# EAGLE design 2xVCA (EAGLE 7.1.0)
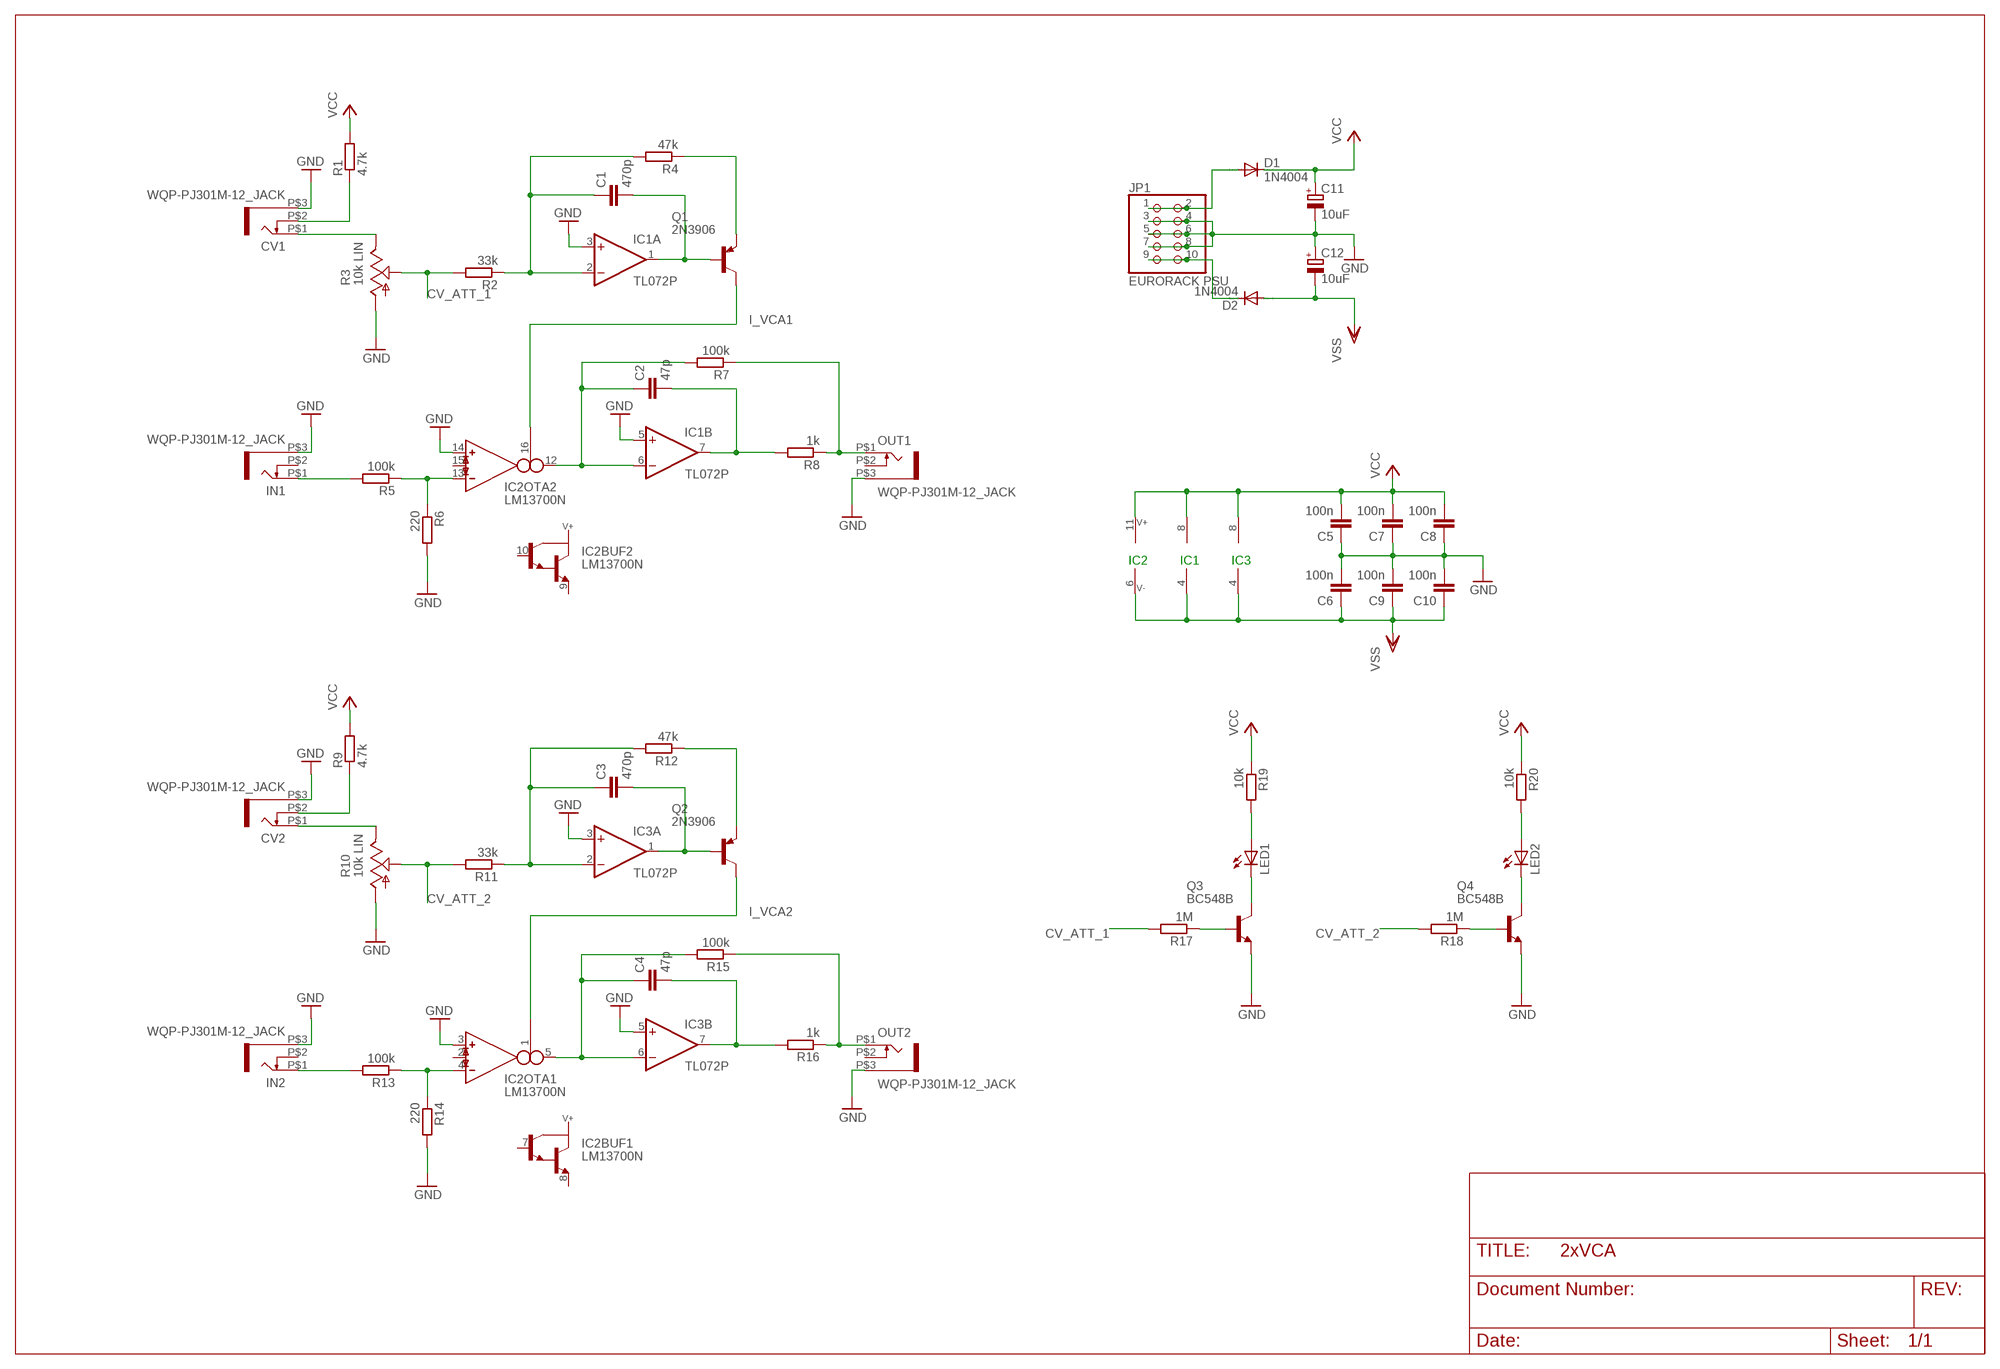
[diagram p0: schematic, sheet 1]

## Parts
C1  470p  C-EU025-025X050  [C025-025X050]
C2  47p  C-EU025-025X050  [C025-025X050]
C3  470p  C-EU025-025X050  [C025-025X050]
C4  47p  C-EU025-025X050  [C025-025X050]
C5  100n  C-EU025-025X050  [C025-025X050]
C6  100n  C-EU025-025X050  [C025-025X050]
C7  100n  C-EU025-025X050  [C025-025X050]
C8  100n  C-EU025-025X050  [C025-025X050]
C9  100n  C-EU025-025X050  [C025-025X050]
C10  100n  C-EU025-025X050  [C025-025X050]
C11  10uF  CPOL-EUE2.5-5  [E2,5-5]
C12  10uF  CPOL-EUE2.5-5  [E2,5-5]
CV1  WQP-PJ301M-12_JACK  [WQP-PJ301M-12_JACK]
CV2  WQP-PJ301M-12_JACK  [WQP-PJ301M-12_JACK]
D1  1N4004  [DO41-10]
D2  1N4004  [DO41-10]
IC1  TL072P  [DIL08]
IC2  LM13700N  [DIL16]
IC3  TL072P  [DIL08]
IN1  WQP-PJ301M-12_JACK  [WQP-PJ301M-12_JACK]
IN2  WQP-PJ301M-12_JACK  [WQP-PJ301M-12_JACK]
JP1  EURORACK PSU  PINHD-2X5  [2X05]
LED1  LED3MM  [LED3MM]
LED2  LED3MM  [LED3MM]
OUT1  WQP-PJ301M-12_JACK  [WQP-PJ301M-12_JACK]
OUT2  WQP-PJ301M-12_JACK  [WQP-PJ301M-12_JACK]
Q1  2N3906  [TO92]
Q2  2N3906  [TO92]
Q3  BC548B  [TO92-EBC]
Q4  BC548B  [TO92-EBC]
R1  4.7k  R-EU_0207/2V  [0207/2V]
R2  33k  R-EU_0207/2V  [0207/2V]
R3  10k LIN  POT_USVERTICAL  [ALPS_POT_VERTICAL]
R4  47k  R-EU_0207/2V  [0207/2V]
R5  100k  R-EU_0207/2V  [0207/2V]
R6  220  R-EU_0207/2V  [0207/2V]
R7  100k  R-EU_0207/2V  [0207/2V]
R8  1k  R-EU_0207/2V  [0207/2V]
R9  4.7k  R-EU_0207/2V  [0207/2V]
R10  10k LIN  POT_USVERTICAL  [ALPS_POT_VERTICAL]
R11  33k  R-EU_0207/2V  [0207/2V]
R12  47k  R-EU_0207/2V  [0207/2V]
R13  100k  R-EU_0207/2V  [0207/2V]
R14  220  R-EU_0207/2V  [0207/2V]
R15  100k  R-EU_0207/2V  [0207/2V]
R16  1k  R-EU_0207/2V  [0207/2V]
R17  1M  R-EU_0207/2V  [0207/2V]
R18  1M  R-EU_0207/2V  [0207/2V]
R19  10k  R-EU_0207/2V  [0207/2V]
R20  10k  R-EU_0207/2V  [0207/2V]

## Nets
CV_ATT_1: R2.2 R3.P$2(S) R17.2
CV_ATT_2: R10.P$2(S) R11.2 R18.2
GND: C5.1 C6.2 C7.1 C8.1 C9.2 C10.2 C11.- C12.+ CV1.P$3 CV2.P$3 IC1.3(A:+IN) IC1.5(B:+IN) IC2.3(OTA1:IN_P) IC2.14(OTA2:IN_P) IC3.3(A:+IN) IC3.5(B:+IN) IN1.P$3 IN2.P$3 JP1.3 JP1.4 JP1.5 JP1.6 JP1.7 JP1.8 OUT1.P$3 OUT2.P$3 Q3.E Q4.E R3.P$3(A) R6.2 R10.P$3(A) R14.2
I_VCA1: IC2.16(OTA2:I_BIAS) Q1.1(C)
I_VCA2: IC2.1(OTA1:I_BIAS) Q2.1(C)
N$1: IN2.P$1 R13.2
N$2: CV1.P$2 R1.1
N$3: CV1.P$1 R3.P$1(E)
N$4: Q3.B R17.1
N$5: C1.1 IC1.2(A:-IN) R2.1 R4.2
N$6: C2.1 IC1.6(B:-IN) IC2.12(OTA2:OUT) R7.2
N$7: C1.2 IC1.1(A:OUT) Q1.2(B)
N$8: Q1.3(E) R4.1
N$9: IC2.13(OTA2:IN_N) R5.1 R6.1
N$10: IC2.4(OTA1:IN_N) R13.1 R14.1
N$11: IN1.P$1 R5.2
N$12: C2.2 IC1.7(B:OUT) R8.2
N$13: OUT1.P$1 R7.1 R8.1
N$15: C4.1 IC2.5(OTA1:OUT) IC3.6(B:-IN) R15.2
N$16: CV2.P$2 R9.1
N$17: CV2.P$1 R10.P$1(E)
N$18: LED1.A R19.2
N$19: C3.1 IC3.2(A:-IN) R11.1 R12.2
N$20: OUT2.P$1 R15.1 R16.1
N$21: C3.2 IC3.1(A:OUT) Q2.2(B)
N$22: Q2.3(E) R12.1
N$23: C4.2 IC3.7(B:OUT) R16.2
N$24: LED1.K(C) Q3.C
N$25: LED2.A R20.2
N$26: LED2.K(C) Q4.C
N$27: Q4.B R18.1
N$28: D1.A JP1.1 JP1.2
N$30: D2.C JP1.9 JP1.10
VCC: C5.2 C7.2 C8.2 C11.+ D1.C IC1.8(P:V+) IC2.11(SUPPLY:V+) IC3.8(P:V+) R1.2 R9.2 R19.1 R20.1
VSS: C6.1 C9.1 C10.1 C12.- D2.A IC1.4(P:V-) IC2.6(SUPPLY:V-) IC3.4(P:V-)
Unconnected: IC2.2(OTA1:I_DIODE) IC2.7(BUF1:B) IC2.8(BUF1:E) IC2.9(BUF2:E) IC2.10(BUF2:B) IC2.15(OTA2:I_DIODE) IN1.P$2 IN2.P$2 OUT1.P$2 OUT2.P$2

## Notes on the sheet
- IC2 | IC1 | IC3

## Library data of the parts
C1-C10 = rcl:C-EU: CAPACITOR, European symbol
C11 C12 = rcl:CPOL-EU: POLARIZED CAPACITOR, European symbol
CV1 CV2 IN1 IN2 OUT1 OUT2 = thonkiconn:WQP-PJ301M-12_JACK
D1 D2 = diode:1N4004: DIODE general purpose rectifier, 1 A
IC1 IC3 = linear:TL072: OP AMP
IC2 = ota:LM13700: Dual OTA with buffers
JP1 = pinhead:PINHD-2X5: PIN HEADER
LED1 LED2 = led:LED: LED OSRAM: - CHIPLED LG R971, LG N971, LY N971, LG Q971, LY Q971, LO R971, LY R971 LH N974, LH R974 LS Q976, LO Q976, LY Q976 LO Q996 - Hyper CHIPLED LW Q18S LB Q993, LB Q99A, LB R99A - SideLED LS A670, LO A670, LY A670, LG A670, LP A670 LB A673, LV A673, LT A673, LW A673 LH A674 LY A675 LS A676, LA A676, LO A676, LY A676, LW A676 LS A679, LY A679, LG A679 - Hyper Micro SIDELED® LS Y876, LA Y876, LO Y876, LY Y876 LT Y87S - SmartLED LW L88C, LW L88S LB L89C, LB L89S, LG L890 LS L89K, LO L89K, LY L89K LS L896, LA L896, LO L896, LY L896 - TOPLED LS T670, LO T670, LY T670, LG T670, LP T670 LSG T670, LSP T670, LSY T670, LOP T670, LYG T670 LG T671, LOG T671, LSG T671 LB T673, LV T673, LT T673, LW T673 LH T674 LS T676, LA T676, LO T676, LY T676, LB T676, LH T676, LSB T676, LW T676 LB T67C, LV T67C, LT T67C, LS T67K, LO T67K, LY T67K, LW E67C LS E67B, LA E67B, LO E67B, LY E67B, LB E67C, LV E67C, LT E67C LW T67C LS T679, LY T679, LG T679 LS T770, LO T770, LY T770, LG T770, LP T770 LB T773, LV T773, LT T773, LW T773 LH T774 LS E675, LA E675, LY E675, LS T675 LS T776, LA T776, LO T776, LY T776, LB T776 LHGB T686 LT T68C, LB T68C - Hyper Mini TOPLED® LB M676 - Mini TOPLED Santana® LG M470 LS M47K, LO M47K, LY M47K Source: http://www.osram.convergy.de LUXEON: - LUMILED® LXK2-PW12-R00, LXK2-PW12-S00, LXK2-PW14-U00, LXK2-PW14-V00 LXK2-PM12-R00, LXK2-PM12-S00, LXK2-PM14-U00 LXK2-PE12-Q00, LXK2-PE12-R00, LXK2-PE12-S00, LXK2-PE14-T00, LXK2-PE14-U00 LXK2-PB12-K00, LXK2-PB12-L00, LXK2-PB12-M00, LXK2-PB14-N00, LXK2-PB14-P00, LXK2-PB14-Q00 LXK2-PR12-L00, LXK2-PR12-M00, LXK2-PR14-Q00, LXK2-PR14-R00 LXK2-PD12-Q00, LXK2-PD12-R00, LXK2-PD12-S00 LXK2-PH12-R00, LXK2-PH12-S00 LXK2-PL12-P00, LXK2-PL12-Q00, LXK2-PL12-R00 Source: www.luxeon.com KINGBRIGHT: KA-3528ASYC Source: www.kingbright.com
Q1 Q2 = transistor-pnp:2N3906: PNP Transistor
Q3 Q4 = transistor-npn:BC548*: NPN Transistor
R1 R2 R4-R9 R11-R20 = rcl:R-EU_: RESISTOR, European symbol
R3 R10 = pot-alps:POT_US

## Board
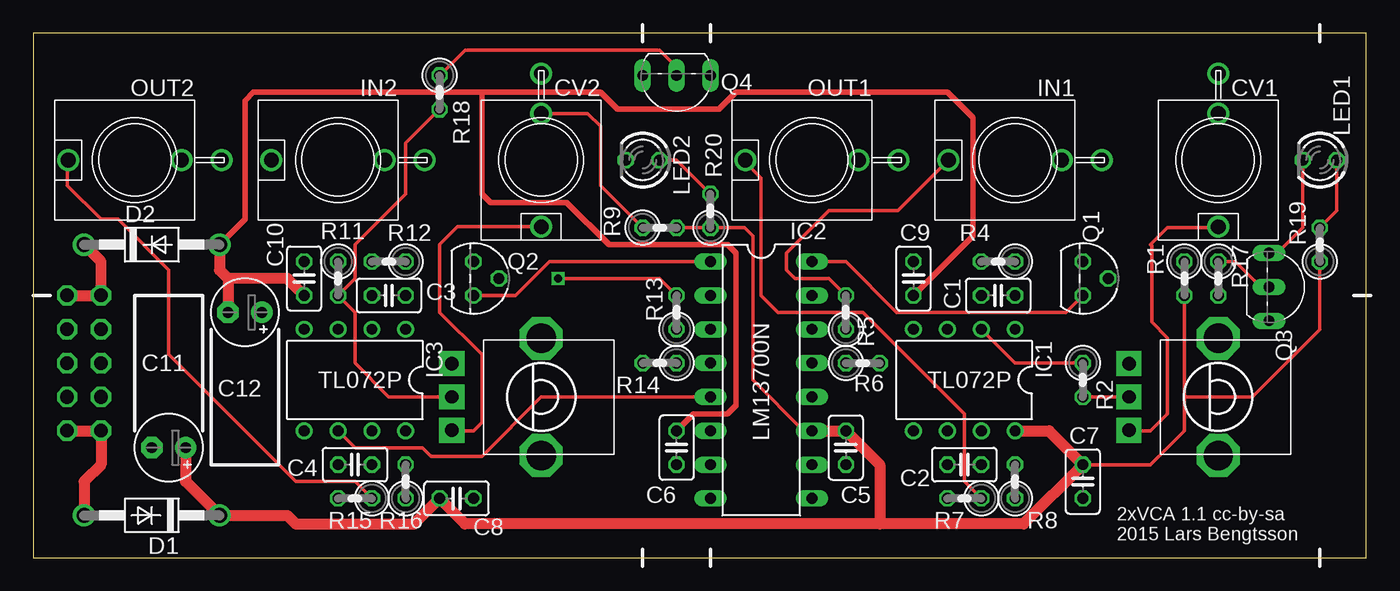
[diagram p1: board, top side]
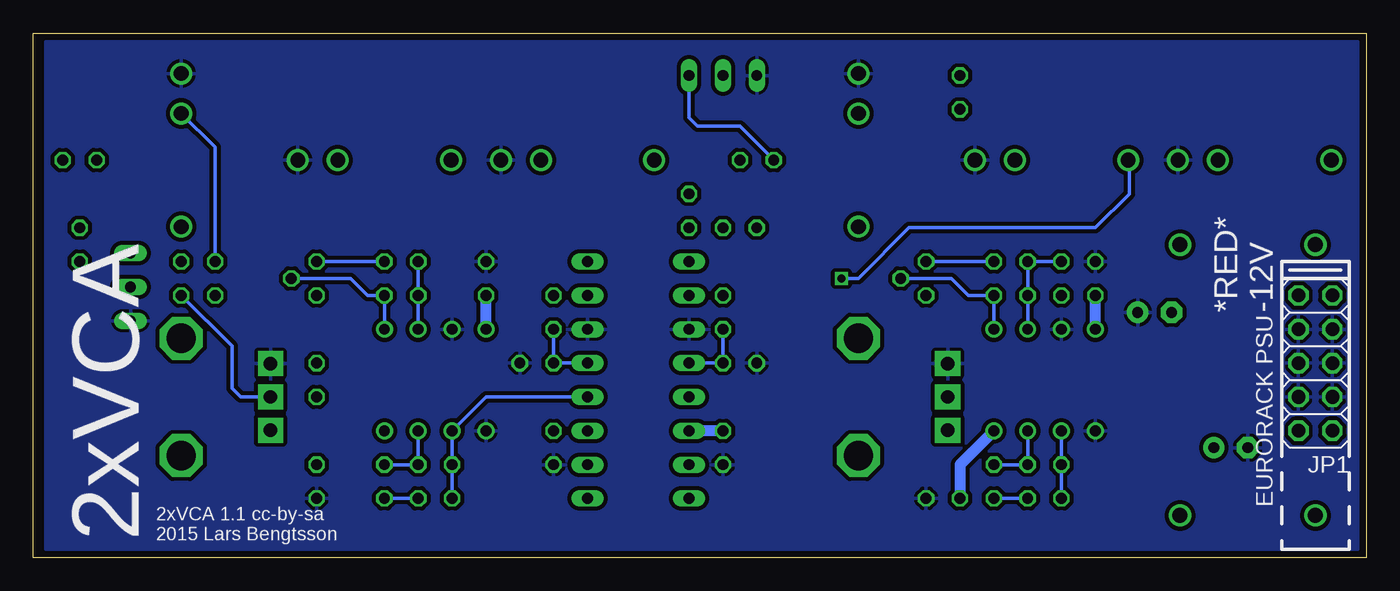
[diagram p2: board, bottom side, seen from below]

Size 100 x 39.36 mm. Coordinates in mm from the lower left corner, seen from the top.
Outline: 0,0 100,0 100,39.36 0,39.36 0,0
Copper layers (1*16): Top 0.0356mm / dielectric 1.5011mm / Bottom 0.0356mm
Design rules "LaenPCBOrder": minimum track width 6mil, minimum drill 13mil, track to track 6mil, track to pad 6mil, pad to pad 6mil, via to via 6mil, smd to smd 6mil, copper to edge 15mil, drill to drill 6mil, minimum pad ring 7mil, minimum via ring 7mil, stop-mask expansion 3mil, vias tented up to drill 0mil, thermal gap 10mil

### Footprints (pad centres in the part's own frame; a part is rotated, then mirrored left to right if it is on the bottom)
C025-025X050 = drill 0.813 octagon: 1 -1.27,0; 2 1.27,0
E2,5-5 = drill 0.813 pad 1.6: + -1.27,0 | drill 0.813 pad 1.6 octagon: - 1.27,0
WQP-PJ301M-12_JACK = drill 1.1: P$1 0,5; P$2 0,-3.5; P$3 0,-6.5
DO41-10 = drill 1.118: A 5.08,0; C -5.08,0
DIL08 = drill 0.813 pad 1.27: 1 -3.81,-3.81; 2 -1.27,-3.81; 3 1.27,-3.81; 4 3.81,-3.81; 5 3.81,3.81; 6 1.27,3.81; 7 -1.27,3.81; 8 -3.81,3.81
DIL16 = drill 0.813 long: 1 -8.89,-3.81; 2 -6.35,-3.81; 3 -3.81,-3.81; 4 -1.27,-3.81; 5 1.27,-3.81; 6 3.81,-3.81; 7 6.35,-3.81; 8 8.89,-3.81; 9 8.89,3.81; 10 6.35,3.81; 11 3.81,3.81; 12 1.27,3.81; 13 -1.27,3.81; 14 -3.81,3.81; 15 -6.35,3.81; 16 -8.89,3.81
2X05 = drill 1.016 octagon: 1 -5.08,-1.27; 2 -5.08,1.27; 3 -2.54,-1.27; 4 -2.54,1.27; 5 0,-1.27; 6 0,1.27; 7 2.54,-1.27; 8 2.54,1.27; 9 5.08,-1.27; 10 5.08,1.27
LED3MM = drill 0.813 octagon: A -1.27,0; K 1.27,0
TO92 = drill 0.813 octagon: 1 1.27,0; 2 0,1.905; 3 -1.27,0
TO92-EBC = drill 0.813 long: B 0,-1.27; C -2.54,-1.27; E 2.54,-1.27
0207/2V = drill 0.813 octagon: 1 -1.27,0; 2 1.27,0
ALPS_POT_VERTICAL = drill 1 pad 1.88 square: P$1 -2.5,6.7; P$2 0,6.7; P$3 2.5,6.7 | drill 2.2 pad 3.175 octagon: P$4 -4.4,0; P$5 4.4,0

### Placement (x,y rotation side)
C1  72.39,19.68 0 top
C2  69.85,6.99 0 top
C3  26.67,19.68 0 top
C4  24.13,6.99 0 top
C5  60.96,8.26 90 top
C6  48.26,8.26 270 top
C7  78.74,5.71 90 top
C8  31.75,4.45 180 top
C9  66.04,20.95 90 top
C10  20.32,20.95 90 top
C11  10.16,8.26 180 top
C12  15.88,18.41 180 top
CV1  88.9,29.84 180 top
CV2  38.1,29.84 180 top
D1  8.89,3.17 180 top
D2  8.89,23.49 0 top
IC1  69.85,13.34 180 top
IC2  54.61,13.34 270 top
IC3  24.13,13.34 180 top
IN1  73.66,29.84 90 top
IN2  22.86,29.84 90 top
JP1  3.81,14.61 90 bottom
LED1  96.52,29.84 180 top
LED2  45.72,29.84 180 top
OUT1  58.42,29.84 90 top
OUT2  7.62,29.84 90 top
Q1  78.74,20.95 270 top
Q2  33.02,20.95 270 top
Q3  93.98,20.32 270 top
Q4  48.26,34.93 180 top
R1  86.36,20.95 270 top
R2  78.74,13.34 270 top
R3  88.9,12.06 90 top
R4  72.39,22.22 180 top
R5  60.96,18.41 90 top
R6  62.23,14.61 0 top
R7  69.85,4.45 180 top
R8  73.66,5.71 90 top
R9  46.99,24.76 0 top
R10  38.1,12.06 90 top
R11  22.86,20.95 270 top
R12  26.67,22.22 180 top
R13  48.26,18.41 90 top
R14  46.99,14.61 180 top
R15  24.13,4.45 180 top
R16  27.94,5.71 90 top
R17  88.9,20.95 270 top
R18  30.48,34.93 270 top
R19  96.52,23.49 90 top
R20  50.8,26.04 90 top

### Tracks (layer width: path | path; a pad name or v marks a point on that pad's centre or on a via)
CV_ATT_1
  Top 0.254: R3.P$2 R2.2
  Bottom 0.254: R17.2 85.09,15.88 85.09,12.7 84.45,12.06 R3.P$2
CV_ATT_2
  Top 0.254: R10.P$2 26.67,12.06 24.13,14.61 24.13,18.41 R11.2 24.13,20.95 24.13,23.49 27.94,27.3 27.94,31.11 R18.2
GND
  pour Bottom (isolate 0.305): 0.64,38.73 99.06,38.73 99.06,0.64 0.64,0.64
I_VCA1
  Top 0.254: Q1.1 77.47,18.41 64.77,18.41 60.96,22.22 IC2.16
I_VCA2
  Top 0.254: IC2.1 38.73,22.22 36.2,19.68 Q2.1
N$1  (via drill 0.6)
  Top 0.254: R13.2 46.99,20.95 v39.37,20.95
  Bottom 0.254: v39.37,20.95 38.1,20.95 34.29,24.76 20.32,24.76 17.78,27.3 17.78,29.76 IN2.P$1
N$2
  Bottom 0.254: R1.1 86.36,30.8 CV1.P$2
N$3
  Top 0.254: R3.P$1 82.24,9.53 83.82,9.53 85.09,10.79 85.09,16.51 83.9,17.7 83.9,23.41 83.82,23.49 85.09,24.76 88.82,24.76 CV1.P$1
N$4
  Top 0.254: Q3.B 92.08,20.32 90.17,22.22 R17.1
N$5
  Top 0.254: R2.1 73.66,14.61 IC1.2
  Bottom 0.254: IC1.2 C1.1 R4.2
N$6
  Bottom 0.254: R7.2 C2.1 IC1.6 66.04,12.06 IC2.12
N$7
  Bottom 0.254: IC1.1 C1.2 74.93,19.68 76.2,20.95 Q1.2
N$8
  Bottom 0.254: Q1.3 R4.1
N$9
  Bottom 0.254: IC2.13 R6.1 R5.1
N$10
  Bottom 0.254: IC2.4 R14.1 R13.1
N$11
  Top 0.254: R5.2 59.69,20.95 57.15,20.95 56.52,21.59 56.52,22.86 59.69,26.04 64.85,26.04 IN1.P$1
N$12
  Bottom 0.254: IC1.7 C2.2 R8.2
N$13
  Top 0.254: R7.1 69.85,5.71 69.85,10.79 62.23,18.41 55.88,18.41 54.61,19.68 54.61,28.49 53.34,29.76 OUT1.P$1
  Bottom 0.254: R7.1 R8.1
N$15
  Top 0.254: IC3.6 24.13,8.26 29.21,8.26 29.84,7.62 33.66,7.62 38.1,12.06 IC2.5
  Bottom 0.254: IC3.6 C4.1 R15.2
N$16
  Top 0.254: CV2.P$2 41.59,33.34 42.55,32.39 42.55,27.94 R9.1
N$17
  Top 0.254: R10.P$1 31.44,9.53 33.02,9.53 33.66,10.16 33.66,15.24 30.48,18.41 30.48,23.49 31.83,24.84 CV2.P$1
N$18
  Top 0.254: LED1.A 97.79,26.04 R19.2
N$19
  Bottom 0.254: IC3.2 C3.1 R12.2 R11.1
N$20
  Top 0.254: R15.1 24.13,5.71 19.68,5.71 10.16,15.24 10.16,21.59 6.35,25.4 5.08,25.4 2.54,27.94 2.54,29.76 OUT2.P$1
  Bottom 0.254: R16.1 R15.1
N$21
  Bottom 0.254: IC3.1 C3.2 29.84,19.68 31.11,20.95 Q2.2
N$22
  Bottom 0.254: R12.1 Q2.3
N$23
  Bottom 0.254: IC3.7 C4.2 R16.2
N$24
  Top 0.254: LED1.K 95.25,24.76 93.34,22.86 Q3.C
N$25
  Top 0.254: LED2.A 48.26,29.84 R20.2
N$26
  Bottom 0.254: Q4.C 50.8,33.02 50.16,32.39 46.99,32.39 LED2.K
N$27
  Top 0.254: R18.1 32.38,38.1 46.99,38.1 48.26,36.83 Q4.B
N$28
  Top 0.813: JP1.1 JP1.2 5.08,6.99 3.81,5.71 D1.A
N$30
  Top 0.813: JP1.9 JP1.10 5.08,22.22 D2.C
VCC
  Top 0.254: R1.2 86.36,12.06 | 86.36,12.06 86.36,9.53 83.82,6.99 C7.2 | IC2.11 57.78,9.53 53.98,13.34 53.98,24.13 53.34,24.76 R20.1 R9.2 | R19.1 96.52,17.14 91.44,12.06 86.36,12.06
  Top 0.813: C11.+ 11.43,5.71 D1.C 19.05,3.17 19.68,2.54 28.57,2.54 C8.2 32.38,2.54 63.5,2.54 | IC2.11 C5.2 63.5,6.99 63.5,2.54 | IC1.8 76.2,9.53 C7.2 74.3,2.54 63.5,2.54
  Bottom 0.813: IC3.8 30.48,6.99 C8.2
VSS
  Top 0.406: C6.1 49.53,10.79 52.07,10.79 52.7,11.43 52.7,22.86 52.07,23.49 43.18,23.49 40.01,26.67 34.29,26.67 33.66,27.3 33.66,34.93 | C9.1 70.48,24.13 70.48,33.02 68.58,34.93 52.7,34.93 51.44,33.66 43.81,33.66 42.55,34.93 33.66,34.93 | D2.A 15.88,25.4 15.88,34.29 16.51,34.93 33.66,34.93
  Top 0.813: D2.A 13.97,21.59 14.61,20.95 | 14.61,20.95 C12.- | C10.1 19.05,20.95 14.61,20.95
  Bottom 0.813: IC3.4 C10.1 | IC1.4 C9.1 | C6.1 IC2.6

### Text on the board
tPlace: 2xVCA 1.1 cc-by-sa / 2015 Lars Bengtsson
bPlace: *RED* / -12V | 2xVCA 1.1 cc-by-sa / 2015 Lars Bengtsson | 2xVCA